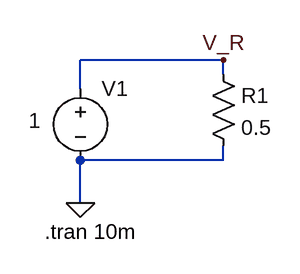
[diagram p0: schematic Test.asc]
Test.asc, the LTspice schematic file:
Version 4
SHEET 1 880 680
WIRE 112 80 -48 80
WIRE 112 96 112 80
WIRE -48 112 -48 80
WIRE 112 192 112 176
WIRE 112 192 -48 192
WIRE -48 240 -48 192
FLAG -48 240 0
FLAG 112 80 V_R
SYMBOL voltage -48 96 R0
WINDOW 3 -58 52 Left 2
WINDOW 123 0 0 Left 2
WINDOW 39 0 0 Left 2
SYMATTR Value 1
SYMATTR InstName V1
SYMBOL res 96 80 R0
SYMATTR InstName R1
SYMATTR Value 0.5
TEXT -88 272 Left 2 !.tran 10m

The netlist it stands for:
* Test.asc
V1 V_R 0 1
R1 V_R 0 0.5
.tran 10m
.backanno
.end